# Altium schematic sheet Ground scheme(coming out of NFETS).SchDoc
size A4
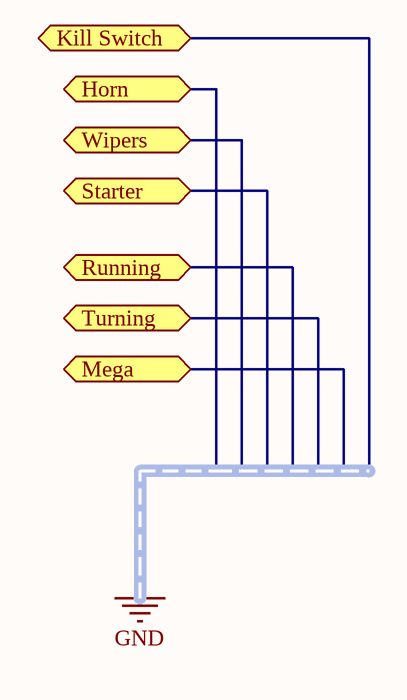
[diagram p0: Ground scheme(coming out of NFETS).SchDoc]

## Ports
Horn, Kill Switch, Mega, Running, Starter, Turning, Wipers

## Notes on the sheet
- Labels drawn without touching a wire or pin: GND